# Altium project Current_Probe.PrjPcb
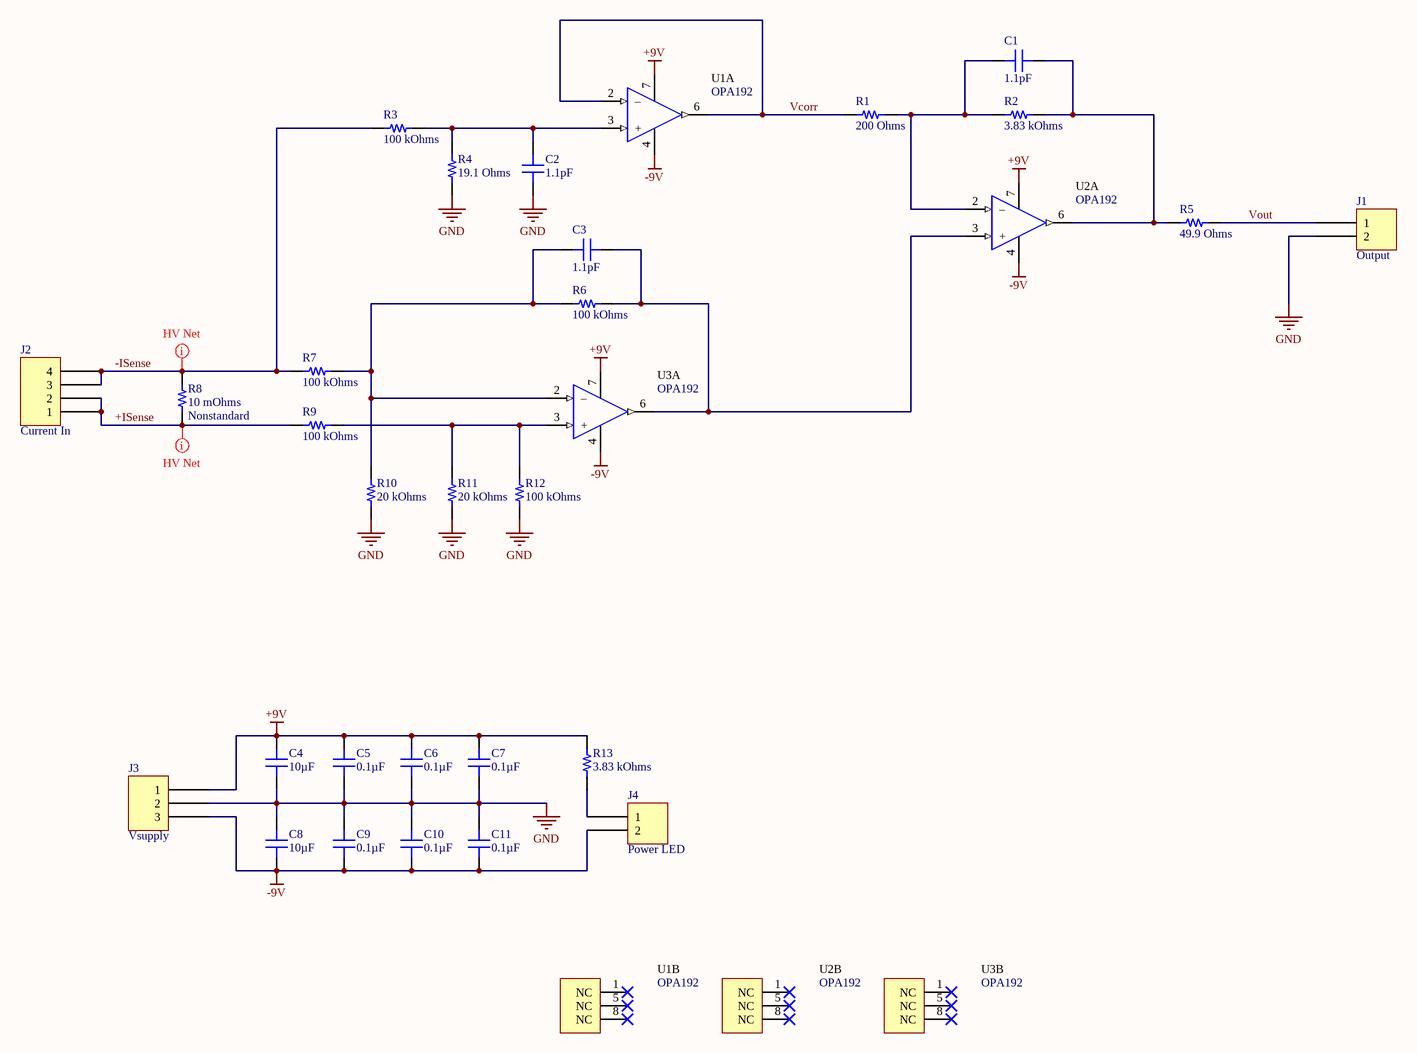
[diagram p0: CurrentProbe.SchDoc]
Layout: Alex Davis; PCB_Rev: A; PRJ_Copyright: ©2020 Alexander M. Davis - All Rights Reserved; PRJ_Customer: Public Release; PRJ_Engineer: Alexander M. Davis; PRJ_Number: DD-0001; PRJ_Title: Current Probe; SCH_Rev: A
1 sheet, 31 parts. Net scope: global (net labels, ports and power ports of the same name join across sheets).
Board file: PCB.PcbDoc

## Sheet CurrentProbe.SchDoc: Current Probe Schematic
size Tabloid; Organization: Davis Designs; Address1: 8921 E. Summer Trail; Address2: Tucson, AZ 85749; DocumentNumber: 1; SheetNumber: 1; SheetTotal: 1

### Parts
C1  1.1pF  [CAP 0805_2012]
C2  1.1pF  [CAP 0805_2012]
C3  1.1pF  [CAP 0805_2012]
C4  10µF  [CAP 0805_2012]
C5  0.1µF  [CAP 0805_2012]
C6  0.1µF  [CAP 0805_2012]
C7  0.1µF  [CAP 0805_2012]
C8  10µF  [CAP 0805_2012]
C9  0.1µF  [CAP 0805_2012]
C10  0.1µF  [CAP 0805_2012]
C11  0.1µF  [CAP 0805_2012]
J1  Output  [MOLEX KK 0022272021]
J2  Current In  [TE 282834-4]
J3  Vsupply  [MOLEX KK 0022272031]
J4  Power LED  [MOLEX KK 0022272021]
R1  200 Ohms  [RES 0805_2012]
R2  3.83 kOhms  [RES 0805_2012]
R3  100 kOhms  [RES 0805_2012]
R4  19.1 Ohms  [RES 0805_2012]
R5  49.9 Ohms  [RES 0805_2012]
R6  100 kOhms  [RES 0805_2012]
R7  100 kOhms  [RES 0805_2012]
R8  10 mOhms  Package / Case: Nonstandard  [VISHAY WSHP2818]
R9  100 kOhms  [RES 0805_2012]
R10  20 kOhms  [RES 0805_2012]
R11  20 kOhms  [RES 0805_2012]
R12  100 kOhms  [RES 0805_2012]
R13  3.83 kOhms  [RES 0805_2012]
U1  OPA192  [SOIC127P600X175-8N]  (parts A,B of 2)
U2  OPA192  [SOIC127P600X175-8N]  (parts A,B of 2)
U3  OPA192  [SOIC127P600X175-8N]  (parts A,B of 2)

### Nets
+9V: C4.2 C5.1 C6.1 C7.1 J3.1 R13.2 U1.7(V+) U2.7(V+) U3.7(V+)
-9V: C8.1 C9.2 C10.2 C11.2 J3.3 J4.2 U1.4(V-) U2.4(V-) U3.4(V-)
GND: C2.2 C4.1 C5.2 C6.2 C7.2 C8.2 C9.1 C10.1 C11.1 J1.2 J3.2 R4.1 R10.1 R11.1 R12.1
+ISense: J2.1 J2.2 R8.1 R9.1
-ISense: J2.3 J2.4 R3.1 R7.1 R8.2
Vcorr: R1.1 U1.2(–) U1.6(Out)
Vout: J1.1 R5.2
NetC1_1: C1.1 R1.2 R2.1 U2.2(–)
NetC1_2: C1.2 R2.2 R5.1 U2.6(Out)
NetC2_1: C2.1 R3.2 R4.2 U1.3(+)
NetC3_1: C3.1 R6.1 R7.2 R10.2 U3.2(–)
NetC3_2: C3.2 R6.2 U2.3(+) U3.6(Out)
NetJ4_1: J4.1 R13.1
NetR9_2: R9.2 R11.2 R12.2 U3.3(+)

Not connected (* = marked no-connect by the designer): U1 1(NC)* 5(NC)* 8(NC)*; U2 1(NC)* 5(NC)* 8(NC)*; U3 1(NC)* 5(NC)* 8(NC)*

### Layout directives
net class HV: +ISense, -ISense

### Library data of the parts
C1-C3 = 600F1R1BT250XT: CAP CER 1.1PF 250V C0G/NP0 0805; Manufacturer: American Technical Ceramics; Temperature Coefficient: C0G, NP0; Tolerance: ±0.1pF; Part Number: 600F1R1BT250XT; Value: 1.1pF; Applications: RF, Microwave, High Frequency, Bypass, Decoupling; Capacitance: 1.1pF; ComponentLink1Description: Datasheet; ComponentLink1URL: http://www.atceramics.com/UserFiles/600f.pdf; ComponentLink2Description: DigiKey Link; ComponentLink2URL: http://digikey.com/product-detail/en/american-technical-ceramics/600F1R1BT250XT/1284-1028-1-ND/3905408; Device Package: 0805 (2012 Metric); Features: High Q, Low Loss, Ultra Low ESR; LastUpdated: 1/21/2020 12:02:44 AM; Lifecycle Status: Active; Minimum Order: 1; Mounting Type: Surface Mount, MLCC; Operating Temperature: -55°C ~ 125°C; Package / Case: 0805 (2012 Metric); Packaging: TapeAndReel; PartId: 15482; Part Status: Active; Price: 0.25; Series: ATC 600F; Size / Dimension: 0.079" L x 0.049" W (2.01mm x 1.24mm); Supplier 1: DigiKey; Supplier Part Number 1: 1284-1028-1-ND; Thickness (Max): 0.051" (1.30mm); Voltage - Rated: 250V
C4 C8 = CL21A106KAYNNNE: CAP CER 10UF 25V X5R 0805; Manufacturer: Samsung Electro-Mechanics; Tolerance: ±10%; Part Number: CL21A106KAYNNNE; Value: 10µF; Applications: General Purpose; Capacitance: 10µF; ComponentLink1Description: Datasheet; ComponentLink1URL: http://www.samsungsem.com/kr/support/product-search/mlcc/CL21A106KAYNNNE.jsp; ComponentLink2Description: DigiKey Link; ComponentLink2URL: http://digikey.com/product-detail/en/samsung-electro-mechanics/CL21A106KAYNNNE/1276-2891-1-ND/3890977; Device Package: 0805 (2012 Metric); LastUpdated: 1/21/2020 12:02:50 AM; Lifecycle Status: Active; Minimum Order: 1; Mounting Type: Surface Mount, MLCC; Operating Temperature: -55°C ~ 85°C; Package / Case: 0805 (2012 Metric); Packaging: TapeAndReel; PartId: 13105; Part Status: Active; Price: 0.05; Series: CL; Size / Dimension: 0.079" L x 0.049" W (2.00mm x 1.25mm); Supplier 1: DigiKey; Supplier Part Number 1: 1276-2891-1-ND; Temperature Coefficient: X5R; Thickness (Max): 0.057" (1.45mm); Voltage - Rated: 25V
C5-C7 C9-C11 = CC0805MRX7R8BB104: CAP CER 0.1UF 25V X7R 0805; Manufacturer: Yageo; Tolerance: ±20%; Part Number: CC0805MRX7R8BB104; Value: 0.1µF; Applications: General Purpose; Capacitance: 0.1µF; ComponentLink1Description: Datasheet; ComponentLink1URL: https://www.yageo.com/upload/media/product/productsearch/datasheet/mlcc/UPY-GPHC_X7R_6.3V-to-50V_18.pdf; ComponentLink2Description: DigiKey Link; ComponentLink2URL: http://digikey.com/product-detail/en/yageo/CC0805MRX7R8BB104/311-4348-1-ND/8025437; Device Package: 0805 (2012 Metric); LastUpdated: 1/21/2020 12:02:57 AM; Lifecycle Status: Active; Minimum Order: 1; Mounting Type: Surface Mount, MLCC; Operating Temperature: -55°C ~ 125°C; Package / Case: 0805 (2012 Metric); Packaging: TapeAndReel; PartId: 8377; Part Status: Active; Price: 0.02; Series: CC; Size / Dimension: 0.079" L x 0.049" W (2.00mm x 1.25mm); Supplier 1: DigiKey; Supplier Part Number 1: 311-4348-1-ND; Temperature Coefficient: X7R; Thickness (Max): 0.037" (0.95mm); Voltage - Rated: 25V
J1 J4 = 0022272021: CONN HEADER VERT 2POS 2.54MM; Manufacturer: Molex; Contact Length - Mating: 0.295" (7.49mm); Contact Length - Post: 0.140" (3.56mm); Material Flammability Rating: UL94 V-0; Number of Positions: 2; Number of Positions Loaded: All; Overall Contact Length: 0.560" (14.22mm); Pitch - Mating: 0.100" (2.54mm); Shrouding: Shrouded - 1 Wall; Style: Board to Cable/Wire; Part Number: 0022272021; ComponentLink1Description: Datasheet; ComponentLink1URL: https://www.molex.com/pdm_docs/sd/022272021_sd.pdf; ComponentLink2Description: DigiKey Link; ComponentLink2URL: http://digikey.com/product-detail/en/molex/0022272021/WM4111-ND/1130577; Connector Type: Header; Contact Finish - Mating: Tin; Contact Finish - Post: Tin; Contact Finish Thickness - Mating: 100.0µin (2.54µm); Contact Material: Brass; Contact Shape: Square; Contact Type: Male Pin; Fastening Type: Friction Lock; Insulation Color: Natural; Insulation Height: 0.461" (11.70mm); Insulation Material: Polyamide (PA), Nylon; LastUpdated: 1/12/2020 11:51:43 PM; Lifecycle Status: Active; Minimum Order: 1; Mounting Type: Through Hole; Number of Rows: 1; Packaging: Bulk; PartId: 76; Part Status: Active; Price: 0.27; Series: KK 6410; Supplier 1: DigiKey; Supplier Part Number 1: WM4111-ND; Termination: Solder
J2 = 282834-4: TERM BLK 4P SIDE ENT 2.54MM PCB; Manufacturer: TE Connectivity AMP Connectors; Current: 10A; Mating Orientation: Horizontal with Board; Number of Levels: 1; Pitch: 0.100" (2.54mm); Positions Per Level: 4; Voltage: 150V; Wire Gauge: 16-30 AWG; Wire Termination: Screw - Rising Cage Clamp; Part Number: 282834-4; Color: Green; ComponentLink1Description: Datasheet; ComponentLink1URL: https://www.te.com/commerce/DocumentDelivery/DDEController?Action=srchrtrv&DocNm=282834&DocType=Customer+Drawing&DocLang=English; ComponentLink2Description: DigiKey Link; ComponentLink2URL: http://digikey.com/product-detail/en/te-connectivity-amp-connectors/282834-4/A98335-ND/1153265; LastUpdated: 1/15/2020 4:16:05 AM; Lifecycle Status: Active; Minimum Order: 1; Mounting Type: Through Hole; Packaging: Bulk; Part Status: Active; Price: 2.68; Series: Buchanan; Supplier 1: DigiKey; Supplier Part Number 1: A98335-ND
J3 = 0022272031: CONN HEADER VERT 3POS 2.54MM; Manufacturer: Molex; Contact Length - Mating: 0.295" (7.49mm); Contact Length - Post: 0.140" (3.56mm); Material Flammability Rating: UL94 V-0; Number of Positions: 3; Number of Positions Loaded: All; Overall Contact Length: 0.560" (14.22mm); Pitch - Mating: 0.100" (2.54mm); Shrouding: Shrouded - 1 Wall; Style: Board to Cable/Wire; Part Number: 0022272031; ComponentLink1Description: Datasheet; ComponentLink1URL: https://www.molex.com/pdm_docs/sd/022272031_sd.pdf; ComponentLink2Description: DigiKey Link; ComponentLink2URL: http://digikey.com/product-detail/en/molex/0022272031/WM4112-ND/1130578; Connector Type: Header; Contact Finish - Mating: Tin; Contact Finish - Post: Tin; Contact Finish Thickness - Mating: 100.0µin (2.54µm); Contact Material: Brass; Contact Shape: Square; Contact Type: Male Pin; Fastening Type: Friction Lock; Insulation Color: Natural; Insulation Height: 0.461" (11.70mm); Insulation Material: Polyamide (PA), Nylon; LastUpdated: 1/12/2020 11:51:54 PM; Lifecycle Status: Active; Minimum Order: 1; Mounting Type: Through Hole; Number of Rows: 1; Packaging: Bulk; PartId: 77; Part Status: Active; Price: 0.37; Series: KK 6410; Supplier 1: DigiKey; Supplier Part Number 1: WM4112-ND; Termination: Solder
R1 = ERJ-PB6B2000V: RES SMD 200 OHM 0.1% 1/4W 0805; Manufacturer: Panasonic Electronic Components; Power (Watts): 0.25W, 1/4W; Temperature Coefficient: ±50ppm/°C; Part Number: ERJ-PB6B2000V; Value: 200 Ohms; ComponentLink1Description: Datasheet; ComponentLink1URL: https://industrial.panasonic.com/cdbs/www-data/pdf/RDM0000/AOA0000C328.pdf; ComponentLink2Description: DigiKey Link; ComponentLink2URL: http://digikey.com/product-detail/en/panasonic-electronic-components/ERJ-PB6B2000V/P20512CT-ND/6214767; Composition: Thick Film; Device Package: 0805 (2012 Metric); Features: Automotive AEC-Q200, Pulse Withstanding; Height - Seated (Max): 0.028" (0.70mm); LastUpdated: 1/21/2020 1:48:33 AM; Lifecycle Status: Active; Minimum Order: 1; Number of Terminations: 2; Operating Temperature: -55°C ~ 155°C; Package / Case: 0805 (2012 Metric); Packaging: TapeAndReel; PartId: 31144; Part Status: Active; Price: 0.04; Ratings: AEC-Q200; Resistance: 200 Ohms; Series: ERJ; Size / Dimension: 0.079" L x 0.049" W (2.00mm x 1.25mm); Supplier 1: DigiKey; Supplier Part Number 1: P20512CT-ND; Supplier Device Package: 0805; Tolerance: ±0.1%
R2 R13 = ERJ-PB6D3831V: RES SMD 3.83K OHM 0.5% 1/4W 0805; Manufacturer: Panasonic Electronic Components; Power (Watts): 0.25W, 1/4W; Temperature Coefficient: ±50ppm/°C; Part Number: ERJ-PB6D3831V; Value: 3.83 kOhms; ComponentLink1Description: Datasheet; ComponentLink1URL: https://industrial.panasonic.com/cdbs/www-data/pdf/RDM0000/AOA0000C328.pdf; ComponentLink2Description: DigiKey Link; ComponentLink2URL: http://digikey.com/product-detail/en/panasonic-electronic-components/ERJ-PB6D3831V/P21084CT-ND/6215339; Composition: Thick Film; Device Package: 0805 (2012 Metric); Features: Automotive AEC-Q200, Pulse Withstanding; Height - Seated (Max): 0.028" (0.70mm); LastUpdated: 1/21/2020 1:46:41 AM; Lifecycle Status: Active; Minimum Order: 1; Number of Terminations: 2; Operating Temperature: -55°C ~ 155°C; Package / Case: 0805 (2012 Metric); Packaging: TapeAndReel; PartId: 35478; Part Status: Active; Price: 0.03; Ratings: AEC-Q200; Resistance: 3.83 kOhms; Series: ERJ; Size / Dimension: 0.079" L x 0.049" W (2.00mm x 1.25mm); Supplier 1: DigiKey; Supplier Part Number 1: P21084CT-ND; Supplier Device Package: 0805; Tolerance: ±0.5%
R3 R6 R7 R9 R12 = ERA-6AEB104V: RES 100K OHM 0.1% 1/8W 0805; Manufacturer: Panasonic Electronic Components; Power (Watts): 0.125W, 1/8W; Temperature Coefficient: ±25ppm/°C; Part Number: ERA-6AEB104V; Value: 100 kOhms; ComponentLink1Description: Datasheet; ComponentLink1URL: https://industrial.panasonic.com/cdbs/www-data/pdf/RDM0000/AOA0000C307.pdf; ComponentLink2Description: DigiKey Link; ComponentLink2URL: http://digikey.com/product-detail/en/panasonic-electronic-components/ERA-6AEB104V/P100KDACT-ND/1465995; Composition: Thin Film; Device Package: 0805 (2012 Metric); Features: Automotive AEC-Q200; Height - Seated (Max): 0.024" (0.60mm); LastUpdated: 1/21/2020 1:49:56 AM; Lifecycle Status: Active; Minimum Order: 1; Number of Terminations: 2; Operating Temperature: -55°C ~ 155°C; Package / Case: 0805 (2012 Metric); Packaging: TapeAndReel; PartId: 28063; Part Status: Active; Price: 0.04; Ratings: AEC-Q200; Resistance: 100 kOhms; Series: ERA-6A; Size / Dimension: 0.079" L x 0.049" W (2.00mm x 1.25mm); Supplier 1: DigiKey; Supplier Part Number 1: P100KDACT-ND; Supplier Device Package: 0805; Tolerance: ±0.1%
R4 = 5-1625868-4: RES SMD 19.1 OHM 0.1% 1/4W 0805; Manufacturer: TE Connectivity Passive Product; Power (Watts): 0.25W, 1/4W; Temperature Coefficient: ±25ppm/°C; Part Number: 5-1625868-4; Value: 19.1 Ohms; ComponentLink1Description: Datasheet; ComponentLink1URL: https://www.te.com/commerce/DocumentDelivery/DDEController?Action=srchrtrv&DocNm=1773272&DocType=DS&DocLang=English; ComponentLink2Description: DigiKey Link; ComponentLink2URL: http://digikey.com/product-detail/en/te-connectivity-passive-product/5-1625868-4/A110378CT-ND/4034733; Composition: Thin Film; Device Package: 0805 (2012 Metric); Height - Seated (Max): 0.026" (0.65mm); LastUpdated: 1/21/2020 1:47:41 AM; Lifecycle Status: Active; Minimum Order: 1; Number of Terminations: 2; Operating Temperature: -55°C ~ 155°C; Package / Case: 0805 (2012 Metric); Packaging: TapeAndReel; PartId: 33143; Part Status: Active; Price: 0.15; Resistance: 19.1 Ohms; Series: RP73P, Holsworthy; Size / Dimension: 0.079" L x 0.049" W (2.00mm x 1.25mm); Supplier 1: DigiKey; Supplier Part Number 1: A110378CT-ND; Supplier Device Package: 0805; Tolerance: ±0.1%
R5 = ERJ-6ENF49R9V: RES SMD 49.9 OHM 1% 1/8W 0805; Manufacturer: Panasonic Electronic Components; Power (Watts): 0.125W, 1/8W; Temperature Coefficient: ±100ppm/°C; Part Number: ERJ-6ENF49R9V; Value: 49.9 Ohms; ComponentLink1Description: Datasheet; ComponentLink1URL: https://industrial.panasonic.com/cdbs/www-data/pdf/RDA0000/AOA0000C304.pdf; ComponentLink2Description: DigiKey Link; ComponentLink2URL: http://digikey.com/product-detail/en/panasonic-electronic-components/ERJ-6ENF49R9V/P49.9CCT-ND/118581; Composition: Thick Film; Device Package: 0805 (2012 Metric); Features: Automotive AEC-Q200; Height - Seated (Max): 0.028" (0.70mm); LastUpdated: 1/21/2020 1:48:04 AM; Lifecycle Status: Active; Minimum Order: 1; Number of Terminations: 2; Operating Temperature: -55°C ~ 155°C; Package / Case: 0805 (2012 Metric); Packaging: TapeAndReel; PartId: 32256; Part Status: Active; Price: 0.01; Ratings: AEC-Q200; Resistance: 49.9 Ohms; Series: ERJ; Size / Dimension: 0.079" L x 0.049" W (2.00mm x 1.25mm); Supplier 1: DigiKey; Supplier Part Number 1: P49.9CCT-ND; Supplier Device Package: 0805; Tolerance: ±1%
R8 = WSHP2818R0100FEA: RES 0.01 OHM 1% 10W 2818; Manufacturer: Vishay Dale; Temperature Coefficient: ±75ppm/°C; Part Number: WSHP2818R0100FEA; ComponentLink1Description: Datasheet; ComponentLink1URL: http://www.vishay.com/docs/30347/wshp2818.pdf; ComponentLink2Description: DigiKey Link; ComponentLink2URL: http://digikey.com/product-detail/en/vishay-dale/WSHP2818R0100FEA/541-3276-1-ND/6605252; Composition: Metal Element; Device Package: Nonstandard; Features: Automotive AEC-Q200, Current Sense, Moisture Resistant, Pulse Withstanding; Height - Seated (Max): 0.069" (1.75mm); LastUpdated: 2/4/2020 3:03:01 AM; Lifecycle Status: Active; Minimum Order: 1; Number of Terminations: 2; Operating Temperature: -65°C ~ 170°C; Packaging: TapeAndReel; PartId: 2681; Part Status: Active; Power (Watts): 10W; Price: 0.62; Ratings: AEC-Q200; Resistance: 10 mOhms; Series: WSHP2818; Size / Dimension: 0.280" L x 0.181" W (7.10mm x 4.60mm); Supplier 1: DigiKey; Supplier Part Number 1: 541-3276-1-ND; Supplier Device Package: 2818; Tolerance: ±1%; Value: 10 mOhms
R10 R11 = ERA-6ARW203V: RES 20K OHM 0.05% 1/8W 0805; Manufacturer: Panasonic Electronic Components; Power (Watts): 0.125W, 1/8W; Temperature Coefficient: ±10ppm/°C; Part Number: ERA-6ARW203V; Value: 20 kOhms; ComponentLink1Description: Datasheet; ComponentLink1URL: https://industrial.panasonic.com/cdbs/www-data/pdf/RDM0000/AOA0000C307.pdf; ComponentLink2Description: DigiKey Link; ComponentLink2URL: http://digikey.com/product-detail/en/panasonic-electronic-components/ERA-6ARW203V/P20KBSCT-ND/3073407; Composition: Thin Film; Device Package: 0805 (2012 Metric); Features: Automotive AEC-Q200; Height - Seated (Max): 0.024" (0.60mm); LastUpdated: 1/21/2020 1:45:31 AM; Lifecycle Status: Active; Minimum Order: 1; Number of Terminations: 2; Operating Temperature: -55°C ~ 155°C; Package / Case: 0805 (2012 Metric); Packaging: TapeAndReel; PartId: 37966; Part Status: Active; Price: 0.24; Ratings: AEC-Q200; Resistance: 20 kOhms; Series: ERA-6A; Size / Dimension: 0.079" L x 0.049" W (2.00mm x 1.25mm); Supplier 1: DigiKey; Supplier Part Number 1: P20KBSCT-ND; Supplier Device Package: 0805; Tolerance: ±0.05%
U1-U3 = OPA192ID: Precision, Rail to Rail I/O, Low Vos, Low Ib Op Amp; Manufacturer: Texas Instruments; Designer: Alex Davis; ComponentLink1Description: Datasheet; ComponentLink1URL: http://www.ti.com/lit/ds/symlink/opa192.pdf; MountType: SMT; RoHS?: Yes; Component Type: Op Amp; Created Date: 2017-09-25; PartNumber: OPA192; Supplier 1: Digi-Key; Supplier Part Number 1: 296-44516-5-ND